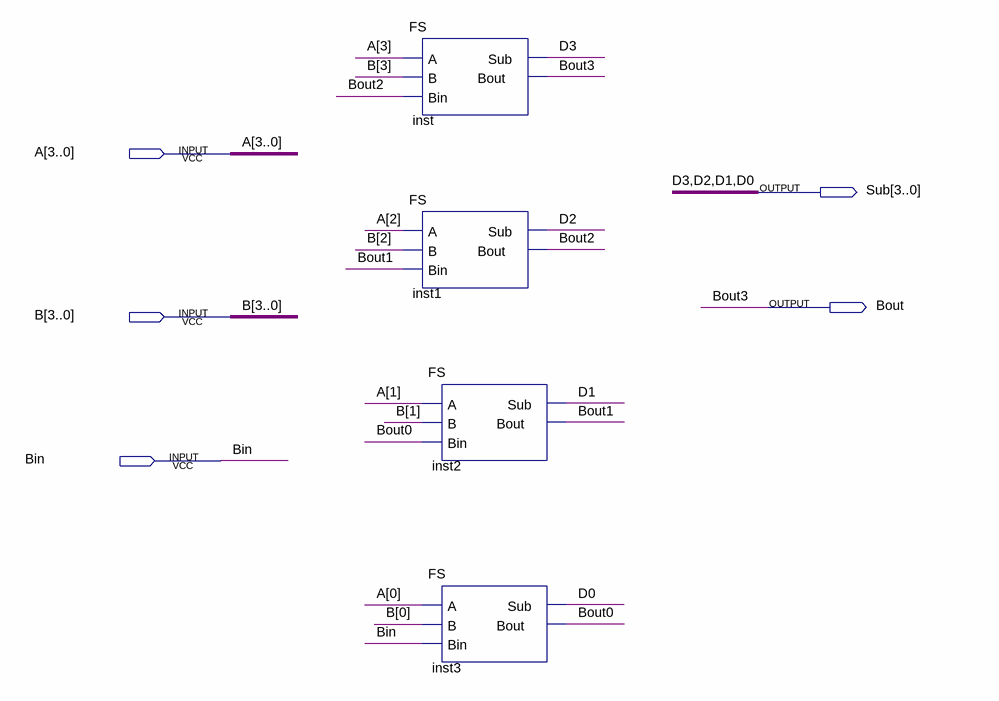
[diagram p0: schematic sheet]
// Quartus schematic FS_4bit.bdf as structural Verilog: 4 symbols, 5 pins
module FS_4bit (
  input  [3:0] A,
  input  [3:0] B,
  input  Bin,
  output [3:0] Sub,
  output Bout
);

  wire Bout0, Bout1, Bout2;

  FS inst (.A(A[3]), .B(B[3]), .Bin(Bout2), .Sub(Sub[3]), .Bout(Bout));
  FS inst1 (.A(A[2]), .B(B[2]), .Bin(Bout1), .Sub(Sub[2]), .Bout(Bout2));
  FS inst2 (.A(A[1]), .B(B[1]), .Bin(Bout0), .Sub(Sub[1]), .Bout(Bout1));
  FS inst3 (.A(A[0]), .B(B[0]), .Bin(Bin), .Sub(Sub[0]), .Bout(Bout0));

  // Other names for the same wires on the sheet: Bout3 = Bout; D0 = Sub[0]; D1 = Sub[1]; D2 = Sub[2]; D3 = Sub[3]
endmodule
